# EAGLE schematic MainECU rev3 (EAGLE 9.2.2)
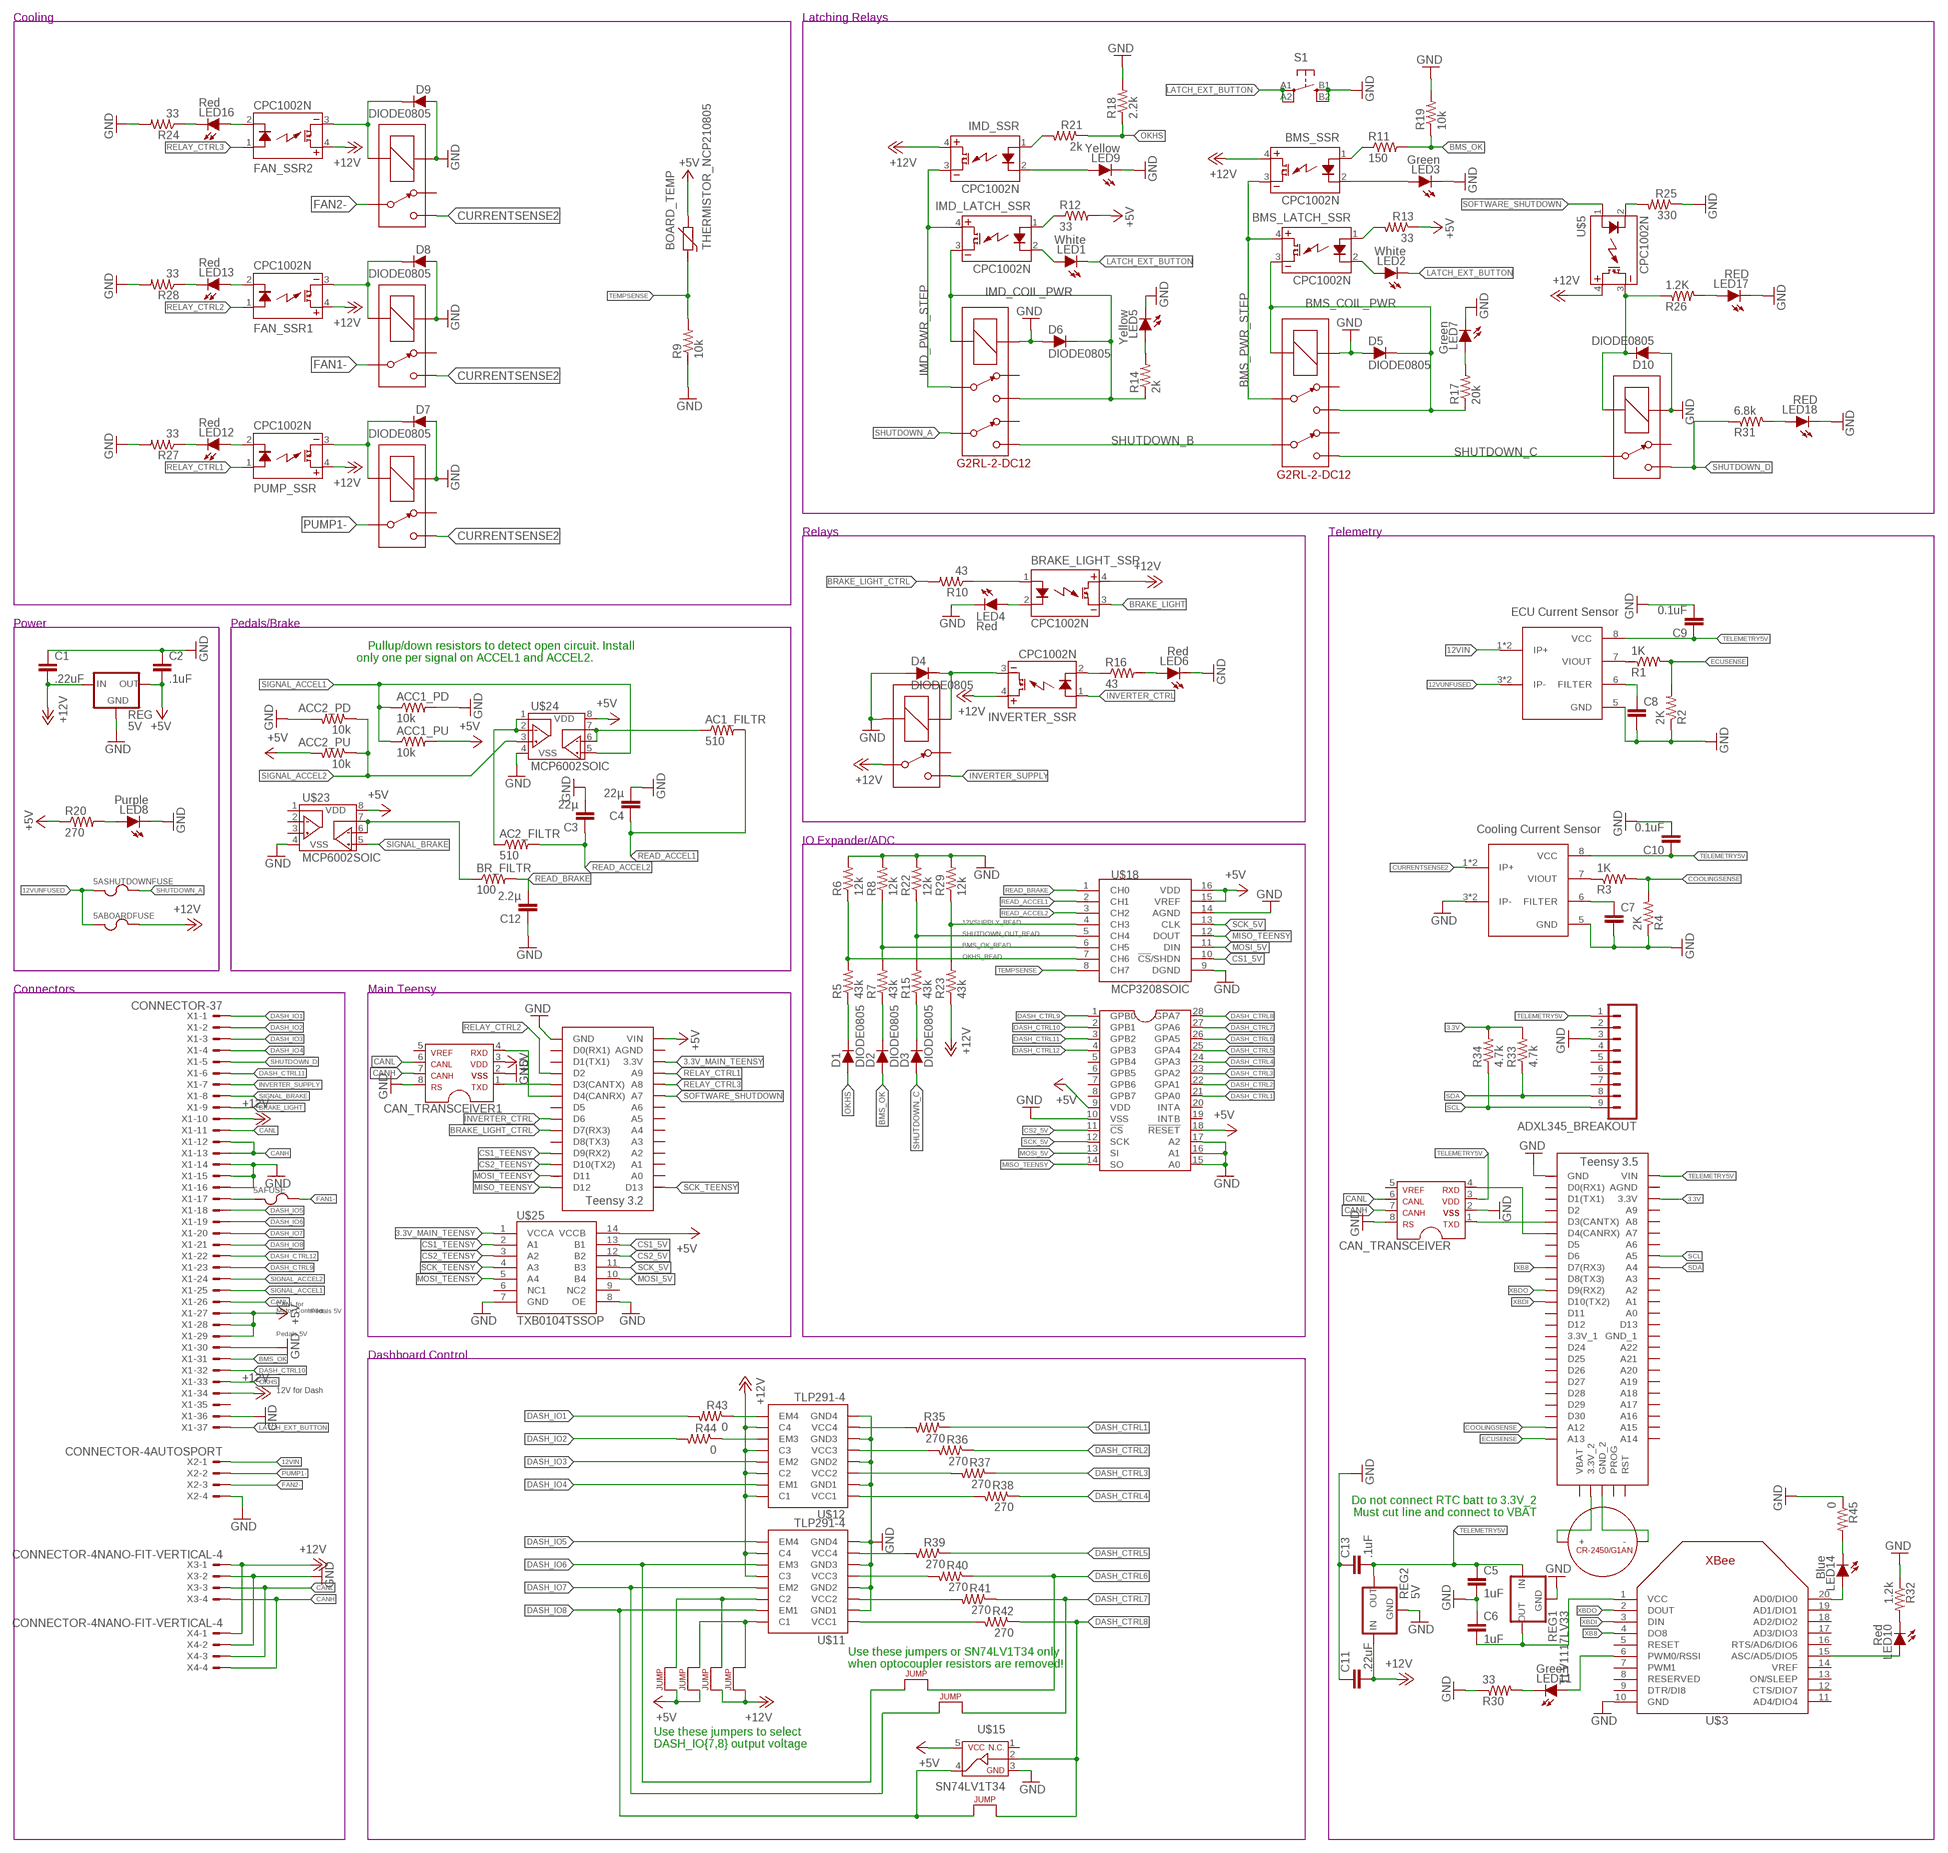
[diagram p0: schematic, sheet 1]

## Parts
5ABOARDFUSE  FUSE_MINIBLADE  [MINI-BLADE_FUSE_HOLDER]
5AFUSE  FUSE_MINIBLADE  [MINI-BLADE_FUSE_HOLDER]
5ASHUTDOWNFUSE  FUSE_MINIBLADE  [MINI-BLADE_FUSE_HOLDER]
AC1_FILTR  510  RESISTOR0805-RES  [0805]
AC2_FILTR  510  RESISTOR0805-RES  [0805]
ACC1_PD  10k  RESISTOR0805-RES  [0805]
ACC1_PU  10k  RESISTOR0805-RES  [0805]
ACC2_PD  10k  RESISTOR0805-RES  [0805]
ACC2_PU  10k  RESISTOR0805-RES  [0805]
ADXL345_BREAKOUT  M09  [1X09]
BMS_LATCH_SSR  CPC1002N  [SOP04]
BMS_SSR  CPC1002N  [SOP04]
BOARD_TEMP  THERMISTOR_NCP210805  [0805]
BR_FILTR  100  RESISTOR0805-RES  [0805]
BRAKE_LIGHT_SSR  CPC1002N  [SOP04]
C1  .22uF  CAP0805  [0805]
C2  .1uF  CAP0805  [0805]
C3  22µ  CAP0805  [0805]
C4  22µ  CAP0805  [0805]
C5  1uF  CAP0805  [0805]
C6  1uF  CAP0805  [0805]
C7  CAP0805  [0805]
C8  CAP0805  [0805]
C9  0.1uF  CAP0805  [0805]
C10  0.1uF  CAP0805  [0805]
C11  .22uF  CAP0805  [0805]
C12  2.2µ  CAP0805  [0805]
C13  .1uF  CAP0805  [0805]
CAN_TRANSCEIVER  MCP2551  [SOIC-08]
CAN_TRANSCEIVER1  MCP2551  [SOIC-08]
D1  DIODE0805  [0805_D]
D2  DIODE0805  [0805_D]
D3  DIODE0805  [0805_D]
D4  DIODE0805  [0805_D]
D5  DIODE0805  [0805_D]
D6  DIODE0805  [0805_D]
D7  DIODE0805  [0805_D]
D8  DIODE0805  [0805_D]
D9  DIODE0805  [0805_D]
D10  DIODE0805  [0805_D]
FAN_SSR1  CPC1002N  [SOP04]
FAN_SSR2  CPC1002N  [SOP04]
IMD_LATCH_SSR  CPC1002N  [SOP04]
IMD_SHUTDOWN  G2RL-2-DC12  [G2RL-2]
IMD_SHUTDOWN1  G2RL-2-DC12  [G2RL-2]
IMD_SSR  CPC1002N  [SOP04]
INVERTER_SSR  CPC1002N  [SOP04]
LED1  White  LED-0805  [LED-805]
LED2  White  LED-0805  [LED-805]
LED3  Green  LED-0805  [LED-805]
LED4  Red  LED-0805  [LED-805]
LED5  Yellow  LED-0805  [LED-805]
LED6  Red  LED-0805  [LED-805]
LED7  Green  LED-0805  [LED-805]
LED8  Purple  LED-0805  [LED-805]
LED9  Yellow  LED-0805  [LED-805]
LED10  Red  LED-0805  [LED-805]
LED11  Green  LED-0805  [LED-805]
LED12  Red  LED-0805  [LED-805]
LED13  Red  LED-0805  [LED-805]
LED14  Blue  LED-0805  [LED-805]
LED16  Red  LED-0805  [LED-805]
LED17  RED  LED-0805  [LED-805]
LED18  RED  LED-0805  [LED-805]
PUMP_SSR  CPC1002N  [SOP04]
R1  1K  RESISTOR0805-RES  [0805]
R2  2K  RESISTOR0805-RES  [0805]
R3  1K  RESISTOR0805-RES  [0805]
R4  2K  RESISTOR0805-RES  [0805]
R5  43k  RESISTOR0805-RES  [0805]
R6  12k  RESISTOR0805-RES  [0805]
R7  43k  RESISTOR0805-RES  [0805]
R8  12k  RESISTOR0805-RES  [0805]
R9  10k  RESISTOR0805-RES  [0805]
R10  43  RESISTOR0805-RES  [0805]
R11  150  RESISTOR0805-RES  [0805]
R12  33  RESISTOR0805-RES  [0805]
R13  33  RESISTOR0805-RES  [0805]
R14  2k  RESISTOR0805-RES  [0805]
R15  43k  RESISTOR0805-RES  [0805]
R16  43  RESISTOR0805-RES  [0805]
R17  20k  RESISTOR0805-RES  [0805]
R18  2.2k  RESISTOR0805-RES  [0805]
R19  10k  RESISTOR0805-RES  [0805]
R20  270  RESISTOR0805-RES  [0805]
R21  2k  RESISTOR0805-RES  [0805]
R22  12k  RESISTOR0805-RES  [0805]
R23  43k  RESISTOR0805-RES  [0805]
R24  33  RESISTOR0805-RES  [0805]
R25  330  RESISTOR0805-RES  [0805]
R26  1.2K  RESISTOR0805-RES  [0805]
R27  33  RESISTOR0805-RES  [0805]
R28  33  RESISTOR0805-RES  [0805]
R29  12k  RESISTOR0805-RES  [0805]
R30  33  RESISTOR0805-RES  [0805]
R31  6.8k  RESISTOR0805-RES  [0805]
R32  1.2k  RESISTOR0805-RES  [0805]
R33  4.7k  RESISTOR0805-RES  [0805]
R34  4.7k  RESISTOR0805-RES  [0805]
R35  270  RESISTOR0805-RES  [0805]
R36  270  RESISTOR0805-RES  [0805]
R37  270  RESISTOR0805-RES  [0805]
R38  270  RESISTOR0805-RES  [0805]
R39  270  RESISTOR0805-RES  [0805]
R40  270  RESISTOR0805-RES  [0805]
R41  270  RESISTOR0805-RES  [0805]
R42  270  RESISTOR0805-RES  [0805]
R43  0  RESISTOR0805-RES  [0805]
R44  0  RESISTOR0805-RES  [0805]
R45  0  RESISTOR0805-RES  [0805]
REG  5V  OKI-78SR  [OKI-78SR]
REG1  TLV1117LV33  [SOT223]
REG2  5V  OKI-78SR  [OKI-78SR]
S1  BTN_10-XXSMD  [TACTILE_SWITCH_SMD_6.2MM_TALL]
SOFTWARE_SHUTOFF  G5LE  [ZF112]
U$1  TEENSY_3.2_SIMPLE  [TEENSY_3.2_SIMPLE]
U$2  TEENSY_3.5_EXT  [TEENSY_3.5_EXT]
U$3  XBEE  [XBEE]
U$4  G5LE  [ZF112]
U$5  CPC1002N  [SOP04]
U$6  G5LE  [ZF112]
U$7  G5LE  [ZF112]
U$8  G5LE  [ZF112]
U$9  ACS715_CURRENT_SENSOR  [SOP8]
U$10  ACS715_CURRENT_SENSOR  [SOP8]
U$11  TLP291-4  [SOIC-16]
U$12  TLP291-4  [SOIC-16]
U$13  JUMPER  [0805]
U$14  JUMPER  [0805]
U$15  SN74LV1T34  [SOT-23-5]
U$16  JUMPER  [0805]
U$17  MCP23S17SSOP28  [SSOP28]
U$18  MCP3208SOIC  [SOIC-16]
U$19  JUMPER  [0805]
U$20  JUMPER  [0805]
U$21  JUMPER  [0805]
U$22  JUMPER  [0805]
U$23  MCP6002SOIC  [SOIC-08]
U$24  MCP6002SOIC  [SOIC-08]
U$25  TXB0104TSSOP  [TSSOP-14]
U$26  CR-2450/G1AN  [CR-2450/G1AN]
X1  CONNECTOR-37  [AUTOSPORT_14-35]
X2  CONNECTOR-4AUTOSPORT  [AUTOSPORT_12-04]
X3  CONNECTOR-4NANO-FIT-VERTICAL-4  [NANO-FIT_VERTICAL-4]
X4  CONNECTOR-4NANO-FIT-VERTICAL-4  [NANO-FIT_VERTICAL-4]

## Nets
3.3V: R33.2 R34.2 U$2.3.3V
3.3V_MAIN_TEENSY: U$1.3.3V U$25.1(VCCA)
12VIN: U$9.1(IP+) U$9.2(IP+) X2.P$1
12VSUPPLY_READ: R23.2 R29.1 U$18.4(CH3)
12VUNFUSED: 5ABOARDFUSE.L1 5ABOARDFUSE.L2 5ASHUTDOWNFUSE.L1 5ASHUTDOWNFUSE.L2 U$9.3(IP-) U$9.4(IP-)
+5V: ACC1_PU.2 ACC2_PU.2 BOARD_TEMP.1 C2.2 CAN_TRANSCEIVER1.3 R12.2 R13.1 R20.1 REG.3(OUT) U$1.VIN U$15.5 U$17.9(VDD) U$17.18(!RESET) U$18.15(VREF) U$18.16(VDD) U$20.1 U$22.1 U$23.8(VDD) U$24.8(VDD) U$25.14(VCCB) X1.P$27 X1.P$28 X1.P$29
+12V: 5ABOARDFUSE.R1 5ABOARDFUSE.R2 BMS_SSR.4(DC+) BRAKE_LIGHT_SSR.4(DC+) C1.2 C11.2 FAN_SSR1.4(DC+) FAN_SSR2.4(DC+) IMD_SSR.4(DC+) INVERTER_SSR.4(DC+) PUMP_SSR.4(DC+) R23.1 REG2.1(IN) REG.1(IN) U$5.4(DC+) U$8.P U$11.10(C4) U$11.12(C3) U$12.10(C4) U$12.12(C3) U$12.14(C2) U$12.16(C1) U$16.1 U$21.1 X1.P$10 X1.P$34 X3.P$1 X4.P$1
BMS_COIL_PWR: BMS_LATCH_SSR.3(DC-) D5.C IMD_SHUTDOWN1.4 IMD_SHUTDOWN1.COIL- R17.1
BMS_OK: D2.A R11.2 R19.1 X1.P$31
BMS_OK_READ: R7.2 R8.1 U$18.6(CH5)
BMS_PWR_STEP: BMS_LATCH_SSR.4(DC+) BMS_SSR.3(DC-) IMD_SHUTDOWN1.3
BRAKE_LIGHT: BRAKE_LIGHT_SSR.3(DC-) X1.P$9
BRAKE_LIGHT_CTRL: R10.2 U$1.D7(RX3)
CANH: CAN_TRANSCEIVER1.7 CAN_TRANSCEIVER.7 X1.P$12 X1.P$13 X3.P$4 X4.P$4
CANL: CAN_TRANSCEIVER1.6 CAN_TRANSCEIVER.6 X1.P$11 X1.P$26 X3.P$3 X4.P$3
COOLINGSENSE: R3.2 R4.2 U$2.A12
CS1_5V: U$18.10(!CS!/SHDN) U$25.13(B1)
CS1_TEENSY: U$1.D9(RX2) U$25.2(A1)
CS2_5V: U$17.11(!CS) U$25.12(B2)
CS2_TEENSY: U$1.D10(TX2) U$25.3(A2)
CURRENTSENSE2: U$4.S U$6.S U$7.S U$10.1(IP+) U$10.2(IP+)
DASH_CTRL1: R35.1 U$17.21(GPA0)
DASH_CTRL2: R36.1 U$17.22(GPA1)
DASH_CTRL3: R37.1 U$17.23(GPA2)
DASH_CTRL4: R38.1 U$17.24(GPA3)
DASH_CTRL5: R39.1 U$17.25(GPA4)
DASH_CTRL6: R40.1 U$13.2 U$17.26(GPA5)
DASH_CTRL7: R41.1 U$14.2 U$17.27(GPA6)
DASH_CTRL8: R42.1 U$15.2 U$17.28(GPA7) U$19.2
DASH_CTRL9: U$17.1(GPB0) X1.P$23
DASH_CTRL10: U$17.2(GPB1) X1.P$32
DASH_CTRL11: U$17.3(GPB2) X1.P$6
DASH_CTRL12: U$17.4(GPB3) X1.P$22
DASH_IO1: R43.2 X1.P$1
DASH_IO2: R44.2 X1.P$2
DASH_IO3: U$12.13(EM2) X1.P$3
DASH_IO4: U$12.15(EM1) X1.P$4
DASH_IO5: U$11.9(EM4) X1.P$18
DASH_IO6: U$11.11(EM3) U$13.1 X1.P$19
DASH_IO7: U$11.13(EM2) U$14.1 X1.P$20
DASH_IO8: U$11.15(EM1) U$15.4 U$19.1 X1.P$21
ECUSENSE: R1.2 R2.2 U$2.A13
FAN1-: 5AFUSE.R1 5AFUSE.R2 U$7.P
FAN2-: U$4.P X2.P$3
GND: ACC1_PD.2 ACC2_PD.2 ADXL345_BREAKOUT.3 C1.1 C2.1 C3.2 C4.2 C5.2 C6.1 C7.2 C8.2 C9.2 C10.2 C11.1 C12.1 C13.1 CAN_TRANSCEIVER1.2 CAN_TRANSCEIVER1.8 CAN_TRANSCEIVER.2 CAN_TRANSCEIVER.8 D4.A D5.A D6.A D7.A D8.A D9.A D10.A IMD_SHUTDOWN1.COIL+ IMD_SHUTDOWN.COIL+ LED3.C LED4.C LED5.C LED6.C LED7.C LED8.C LED9.C LED17.C LED18.C R2.1 R4.1 R6.2 R8.2 R9.1 R18.2 R19.2 R22.2 R24.2 R25.1 R27.2 R28.2 R29.2 R30.1 R32.1 R45.1 REG1.1(GND) REG2.2(GND) REG.2(GND) S1.B1(S) S1.B2(S1) SOFTWARE_SHUTOFF.1(COIL+) U$1.GND U$2.GND U$3.10(GND) U$4.1(COIL+) U$6.1(COIL+) U$7.1(COIL+) U$8.2(COIL-) U$9.5(GND) U$10.3(IP-) U$10.4(IP-) U$10.5(GND) U$11.2(GND1) U$11.4(GND2) U$11.6(GND3) U$11.8(GND4) U$12.2(GND1) U$12.4(GND2) U$12.6(GND3) U$12.8(GND4) U$15.3 U$17.10(VSS) U$17.15(A0) U$17.16(A1) U$17.17(A2) U$18.9(DGND) U$18.14(AGND) U$23.4(VSS) U$24.4(VSS) U$25.8(OE) X1.P$14 X1.P$15 X1.P$16 X1.P$30 X1.P$36 X2.P$4 X3.P$2 X4.P$2
IMD_COIL_PWR: D6.C IMD_LATCH_SSR.3(DC-) IMD_SHUTDOWN.4 IMD_SHUTDOWN.COIL- R14.1
IMD_PWR_STEP: IMD_LATCH_SSR.4(DC+) IMD_SHUTDOWN.3 IMD_SSR.3(DC-)
INVERTER_CTRL: INVERTER_SSR.1(CONTROL+) U$1.D6
INVERTER_SUPPLY: U$8.S X1.P$7
LATCH_EXT_BUTTON: LED1.C LED2.C S1.A1(P) S1.A2(P1) X1.P$37
MISO_TEENSY: U$1.D12 U$17.14(SO) U$18.12(DOUT)
MOSI_5V: U$17.13(SI) U$18.11(DIN) U$25.10(B4)
MOSI_TEENSY: U$1.D11 U$25.5(A4)
N$1: 5AFUSE.L1 5AFUSE.L2 X1.P$17
N$2: IMD_LATCH_SSR.2(CONTROL-) LED1.A
N$3: R1.1 U$9.7(VIOUT)
N$4: D7.C PUMP_SSR.3(DC-) U$6.2(COIL-)
N$5: IMD_LATCH_SSR.1(CONTROL+) R12.1
N$6: R3.1 U$10.7(VIOUT)
N$7: BRAKE_LIGHT_SSR.2(CONTROL-) LED4.A
N$8: C8.1 U$9.6(FILTER)
N$9: BMS_SSR.2(CONTROL-) LED3.A
N$10: D1.C R5.1
N$11: D2.C R7.1
N$12: BMS_LATCH_SSR.1(CONTROL+) R13.2
N$13: CAN_TRANSCEIVER.4 U$2.D4(CANRX)
N$14: CAN_TRANSCEIVER.1 U$2.D3(CANTX)
N$15: CAN_TRANSCEIVER1.4 U$1.D4(CANRX)
N$16: BMS_LATCH_SSR.2(CONTROL-) LED2.A
N$17: BRAKE_LIGHT_SSR.1(CONTROL+) R10.1
N$18: BMS_SSR.1(CONTROL+) R11.1
N$19: LED5.A R14.2
N$20: D8.C FAN_SSR1.3(DC-) U$7.2(COIL-)
N$21: D9.C FAN_SSR2.3(DC-) U$4.2(COIL-)
N$22: CAN_TRANSCEIVER1.1 U$1.D3(CANTX)
N$23: AC2_FILTR.1 U$24.1(VOUTA) U$24.2(VINA-)
N$24: AC1_FILTR.1 U$24.6(VINB-) U$24.7(VOUTB)
N$25: BR_FILTR.1 U$23.6(VINB-) U$23.7(VOUTB)
N$26: D4.C INVERTER_SSR.3(DC-) U$8.1(COIL+)
N$27: INVERTER_SSR.2(CONTROL-) R16.1
N$28: LED6.A R16.2
N$29: LED8.A R20.2
N$30: LED16.C R24.1
N$31: IMD_SSR.1(CONTROL+) R21.2
N$32: LED7.A R17.2
N$33: D3.C R15.1
N$34: IMD_SSR.2(CONTROL-) LED9.A
N$35: LED14.C R45.2
N$36: LED13.C R28.1
N$37: LED12.C R27.1
N$38: LED12.A PUMP_SSR.2(CONTROL-)
N$39: FAN_SSR2.2(CONTROL-) LED16.A
N$40: LED18.A R31.2
N$41: U$2.3.3V_2 U$26.+_0(+) U$26.+_1(+)
N$42: FAN_SSR1.2(CONTROL-) LED13.A
N$43: D10.C R26.1 SOFTWARE_SHUTOFF.2(COIL-) U$5.3(DC-)
N$44: R25.2 U$5.2(CONTROL-)
N$45: LED11.C R30.2
N$46: LED17.A R26.2
N$47: LED11.A U$3.6(PWM0/RSSI)
N$48: C7.1 U$10.6(FILTER)
N$49: LED10.A U$3.15(ASC/AD5/DIO5)
N$50: LED10.C R32.2
N$51: R35.2 U$12.7(VCC4)
N$52: R36.2 U$12.5(VCC3)
N$53: R37.2 U$12.3(VCC2)
N$54: R38.2 U$12.1(VCC1)
N$55: R39.2 U$11.7(VCC4)
N$56: R40.2 U$11.5(VCC3)
N$57: R41.2 U$11.3(VCC2)
N$58: R42.2 U$11.1(VCC1)
N$59: R43.1 U$12.9(EM4)
N$60: R44.1 U$12.11(EM3)
N$61: U$11.16(C1) U$16.2 U$20.2
N$62: U$11.14(C2) U$21.2 U$22.2
N$63: LED14.A U$3.20(AD0/DIO0)
N$64: U$2.GND_2 U$26.-
N$65: U$25.7(GND) ; supply symbol labelled GND
OKHS: D1.A R18.1 R21.1 X1.P$33
OKHS_READ: R5.2 R6.1 U$18.7(CH6)
PUMP1-: U$6.P X2.P$2
READ_ACCEL1: AC1_FILTR.2 C4.1 U$18.2(CH1)
READ_ACCEL2: AC2_FILTR.2 C3.1 U$18.3(CH2)
READ_BRAKE: BR_FILTR.2 C12.2 U$18.1(CH0)
RELAY_CTRL1: PUMP_SSR.1(CONTROL+) U$1.A9
RELAY_CTRL2: FAN_SSR1.1(CONTROL+) U$1.D2
RELAY_CTRL3: FAN_SSR2.1(CONTROL+) U$1.A8
SCK_5V: U$17.12(SCK) U$18.13(CLK) U$25.11(B3)
SCK_TEENSY: U$1.D13 U$25.4(A3)
SCL: ADXL345_BREAKOUT.9 R34.1 U$2.A5
SDA: ADXL345_BREAKOUT.8 R33.1 U$2.A4
SHUTDOWN_A: 5ASHUTDOWNFUSE.R1 5ASHUTDOWNFUSE.R2 IMD_SHUTDOWN.6
SHUTDOWN_B: IMD_SHUTDOWN1.6 IMD_SHUTDOWN.5
SHUTDOWN_C: D3.A IMD_SHUTDOWN1.5 SOFTWARE_SHUTOFF.P
SHUTDOWN_D: R31.1 SOFTWARE_SHUTOFF.S X1.P$5
SHUTDOWN_OUT_READ: R15.2 R22.1 U$18.5(CH4)
SIGNAL_ACCEL1: ACC1_PD.1 ACC1_PU.1 U$24.5(VINB+) X1.P$25
SIGNAL_ACCEL2: ACC2_PD.1 ACC2_PU.1 U$24.3(VINA+) X1.P$24
SIGNAL_BRAKE: U$23.5(VINB+) X1.P$8
SOFTWARE_SHUTDOWN: U$1.A7 U$5.1(CONTROL+)
TELEMETRY5V: ADXL345_BREAKOUT.1 C5.1 C9.1 C10.1 C13.2 CAN_TRANSCEIVER.3 REG1.3(IN) REG2.3(OUT) U$2.VIN U$9.8(VCC) U$10.8(VCC)
TEMPSENSE: BOARD_TEMP.2 R9.2 U$18.8(CH7)
VCC: C6.2 REG1.2(OUT) REG1.4(OUT) U$3.1(VCC)
XB8: U$2.D7(RX3) U$3.4(DO8)
XBDI: U$2.D10(TX2) U$3.3(DIN)
XBDO: U$2.D9(RX2) U$3.2(DOUT)
Unconnected: ADXL345_BREAKOUT.2 ADXL345_BREAKOUT.4 ADXL345_BREAKOUT.5 ADXL345_BREAKOUT.6 ADXL345_BREAKOUT.7 CAN_TRANSCEIVER1.5 CAN_TRANSCEIVER.5 IMD_SHUTDOWN1.2 IMD_SHUTDOWN1.7 IMD_SHUTDOWN.2 IMD_SHUTDOWN.7 SOFTWARE_SHUTOFF.O U$1.A0 U$1.A1 U$1.A2 U$1.A3 U$1.A4 U$1.A5 U$1.A6 U$1.AGND U$1.D0(RX1) U$1.D1(TX1) U$1.D5 U$1.D8(TX3) U$2.3.3V_1 U$2.A0 U$2.A1 U$2.A2 U$2.A3 U$2.A6 U$2.A7 U$2.A8 U$2.A9 U$2.A14 U$2.A15 U$2.A16 U$2.A17 U$2.A18 U$2.A19 U$2.A20 U$2.A21 U$2.A22 U$2.AGND U$2.D0(RX1) U$2.D1(TX1) U$2.D2 U$2.D5 U$2.D6 U$2.D8(TX3) U$2.D11 U$2.D12 U$2.D13 U$2.D24 U$2.D25 U$2.D26 U$2.D27 U$2.D28 U$2.D29 U$2.D30 U$2.GND_1 U$2.PROG U$2.RST U$2.VBAT U$3.5(RESET) U$3.7(PWM1) U$3.8(RESERVED) U$3.9(DTR/DI8) U$3.11(AD4/DIO4) U$3.12(CTS/DIO7) U$3.13(ON/SLEEP) U$3.14(VREF) U$3.16(RTS/AD6/DIO6) U$3.17(AD3/DIO3) U$3.18(AD2/DIO2) U$3.19(AD1/DIO1) U$4.O U$6.O U$7.O U$8.O U$15.1 U$17.5(GPB4) U$17.6(GPB5) U$17.7(GPB6) U$17.8(GPB7) U$17.19(INTB) U$17.20(INTA) U$23.1(VOUTA) U$23.2(VINA-) U$23.3(VINA+) U$25.6(NC1) U$25.9(NC2) X1.P$35

## Notes on the sheet
- Cooling | Latching Relays
- Relays | Telemetry
- ECU Current Sensor
- Power | Pedals/Brake
- ⇩ Pullup/down resistors to detect open circuit. Install
  only one per signal on ACCEL1 and ACCEL2.
- Cooling Current Sensor
- IO Expander/ADC
- Connectors | Main Teensy
- CANL for
  Motor Controller
- Pedals 5V
- Pedals 5V
- Dashboard Control
- 12V for Dash
- Do not connect RTC batt to 3.3V_2➡
  Must cut line and connect to VBAT➡
- Use these jumpers or SN74LV1T34 only
  when optocoupler resistors are removed!
- Use these jumpers to select
  DASH_IO{7,8} output voltage

## Library data of the parts
5ABOARDFUSE 5AFUSE 5ASHUTDOWNFUSE = HyTechDevices:FUSE: Fuse/Fuseclips Keystone Electronics 3568 Fuse Mouser Part <http://www.mouser.com/ProductDetail/Keystone-Electronics/3568> Datasheet <http://www.mouser.com/ds/2/215/568-742601.pdf> Bussman/Eaton Midget Fuse Clip 1A3400 <http://www.mouser.com/ProductDetail/Bussmann-Eaton/BK-1A3400-09-R/?qs=sGAEpiMZZMuG%252bgnN5hGYGzzlAelq2OxnKqVSMVjq8I4%3d> Schurter 0751.0110 Brass Fuse Clip Datasheet <http://www.mouser.com/ds/2/358/typ_OG__Clip__5x20-2553.pdf>
AC1_FILTR AC2_FILTR ACC1_PD ACC1_PU ACC2_PD ACC2_PU BR_FILTR R1-R45 = HyTechDevices:RESISTOR: Resistor Basic schematic elements and footprints for 0603, 1206, and PTH resistors.
ADXL345_BREAKOUT = HyTechDevices:M09: Standard 9-pin 0.1" header. Source: Sparkfun <https://github.com/sparkfun/SparkFun-Eagle-Libraries>
BMS_LATCH_SSR BMS_SSR BRAKE_LIGHT_SSR FAN_SSR1 FAN_SSR2 IMD_LATCH_SSR IMD_SSR INVERTER_SSR PUMP_SSR U$5 = HyTechDevices:CPC1002N: IXYS Solid State Relay .7A
BOARD_TEMP = HyTechDevices:THERMISTOR_NCP21: Murata NCP Thermistor Datasheet <http://www.murata.com/~/media/webrenewal/support/library/catalog/products/thermistor/ntc/r44e.ashx>
C1-C13 = HyTechDevices:CAP: Capacitor Standard 0603 ceramic capacitor, and 0.1" leaded capacitor.
CAN_TRANSCEIVER CAN_TRANSCEIVER1 = HyTechDevices:MCP2551: MCP2551 High-Speed CAN Transceiver Product Webpage <https://www.microchip.com/wwwproducts/en/MCP2551> Datasheet <http://ww1.microchip.com/downloads/en/DeviceDoc/21667f.pdf> This device is outdated It is replaced by MCP2561. Comparison Page <https://www.microchip.com/wwwproducts/ProductCompare/MCP2551/MCP2561> Product Webpage <https://www.microchip.com/wwwproducts/en/MCP2561> Datasheet <http://ww1.microchip.com/downloads/en/DeviceDoc/20005167C.pdf>
D1-D10 = HyTechDevices:DIODE: DIODE general purpose rectifier
IMD_SHUTDOWN IMD_SHUTDOWN1 = HyTechDevices:G2RL-2-DC12: Omron G2RL-2 Double Pull Double Throw Relay Coil Voltage: 12VDC (8.4-18VDC @60ºC) Contact Amperage: 8A at 30VDC Datasheet <https://www.omron.com/ecb/products/pdf/en-g2rl.pdf>
LED1-LED14 LED16-LED18 = HyTechDevices:LED: Light Emitting Diode (LED) Source: Dangerous Prototypes Eagle Library <https://github.com/DangerousPrototypes/Eagle_Part_Library>
REG REG2 = HyTechDevices:OKI-78SR: Murata OKI-78SR Non-Isolated Switching Regulator DC/DC - Datasheet <https://power.murata.com/data/power/oki-78sr.pdf>
REG1 = HyTechDevices:TLV1117LV33: Texas Instruments TLV1117LV33 3.3V Linear Regulator
S1 = HyTechDevices:BTN_10-XX: Small momentary tactile push button
SOFTWARE_SHUTOFF U$4 U$6-U$8 = HyTechDevices:G5LE: Omron G5LE SPST Relay 5 VDC, 12VDC, 24VDC models Coil voltage: 75% - 170% of nominal voltage Datasheet <https://www.omron.com/ecb/products/pdf/en-g5le.pdf>
U$1 = HyTechDevices:TEENSY_3.2_SIMPLE: Simple version of the Teensy 3.2 board that only uses the 2 main rows of pins, not the inner pins or the pins opposite the usb port.
U$2 = HyTechDevices:TEENSY_3.5_EXT: Simple version of the Teensy 3.5 board that only uses the 2 main rows of pins, plus the perpendicular row with VBat.
U$3 = HyTechDevices:XBEE: Source: Adafruit <https://github.com/adafruit/Adafruit-Eagle-Library>
U$9 U$10 = HyTechDevices:ACS715_CURRENT_SENSOR
U$11 U$12 = HyTechDevices:TLP291-4: Toshiba Quad Channel Optocoupler TLP291-4
U$13 U$14 U$16 U$19-U$22 = HyTechDevices:JUMPER: Jumper for changing operation of a device
U$15 = HyTechDevices:SN74LV1T34: TI SN74LV1T34 Single Power Supply Single Buffer GATE CMOS Logic Level Shifter Datasheet <http://www.ti.com/lit/ds/symlink/sn74lv1t34.pdf>
U$17 = HyTechDevices:MCP23S17
U$18 = HyTechDevices:MCP3208: Analog to Digital Converter
U$23 U$24 = HyTechDevices:MCP6002: Microchip MCP6002 Dual Channel Op Amp
U$25 = HyTechDevices:TXB0104: Texas Instruments TXB0104 4-channel low voltage to high voltage Logic Level Shifter. Minimum input voltage level 1.8V. Maximum output voltage level 5.5V.
U$26 = HyTechDevices:CR-2450/G1AN: Panasonic CR2450 Battery through hole.
X1 = HyTechDevices:CONNECTOR-37: Mini-Fit Junior connector 12 pole Source: http://www.molex.com
X2-X4 = HyTechDevices:CONNECTOR-4: Mini-Fit Junior connector 4 pole Source: http://www.molex.com